# EAGLE design daq (EAGLE 9.3.0)
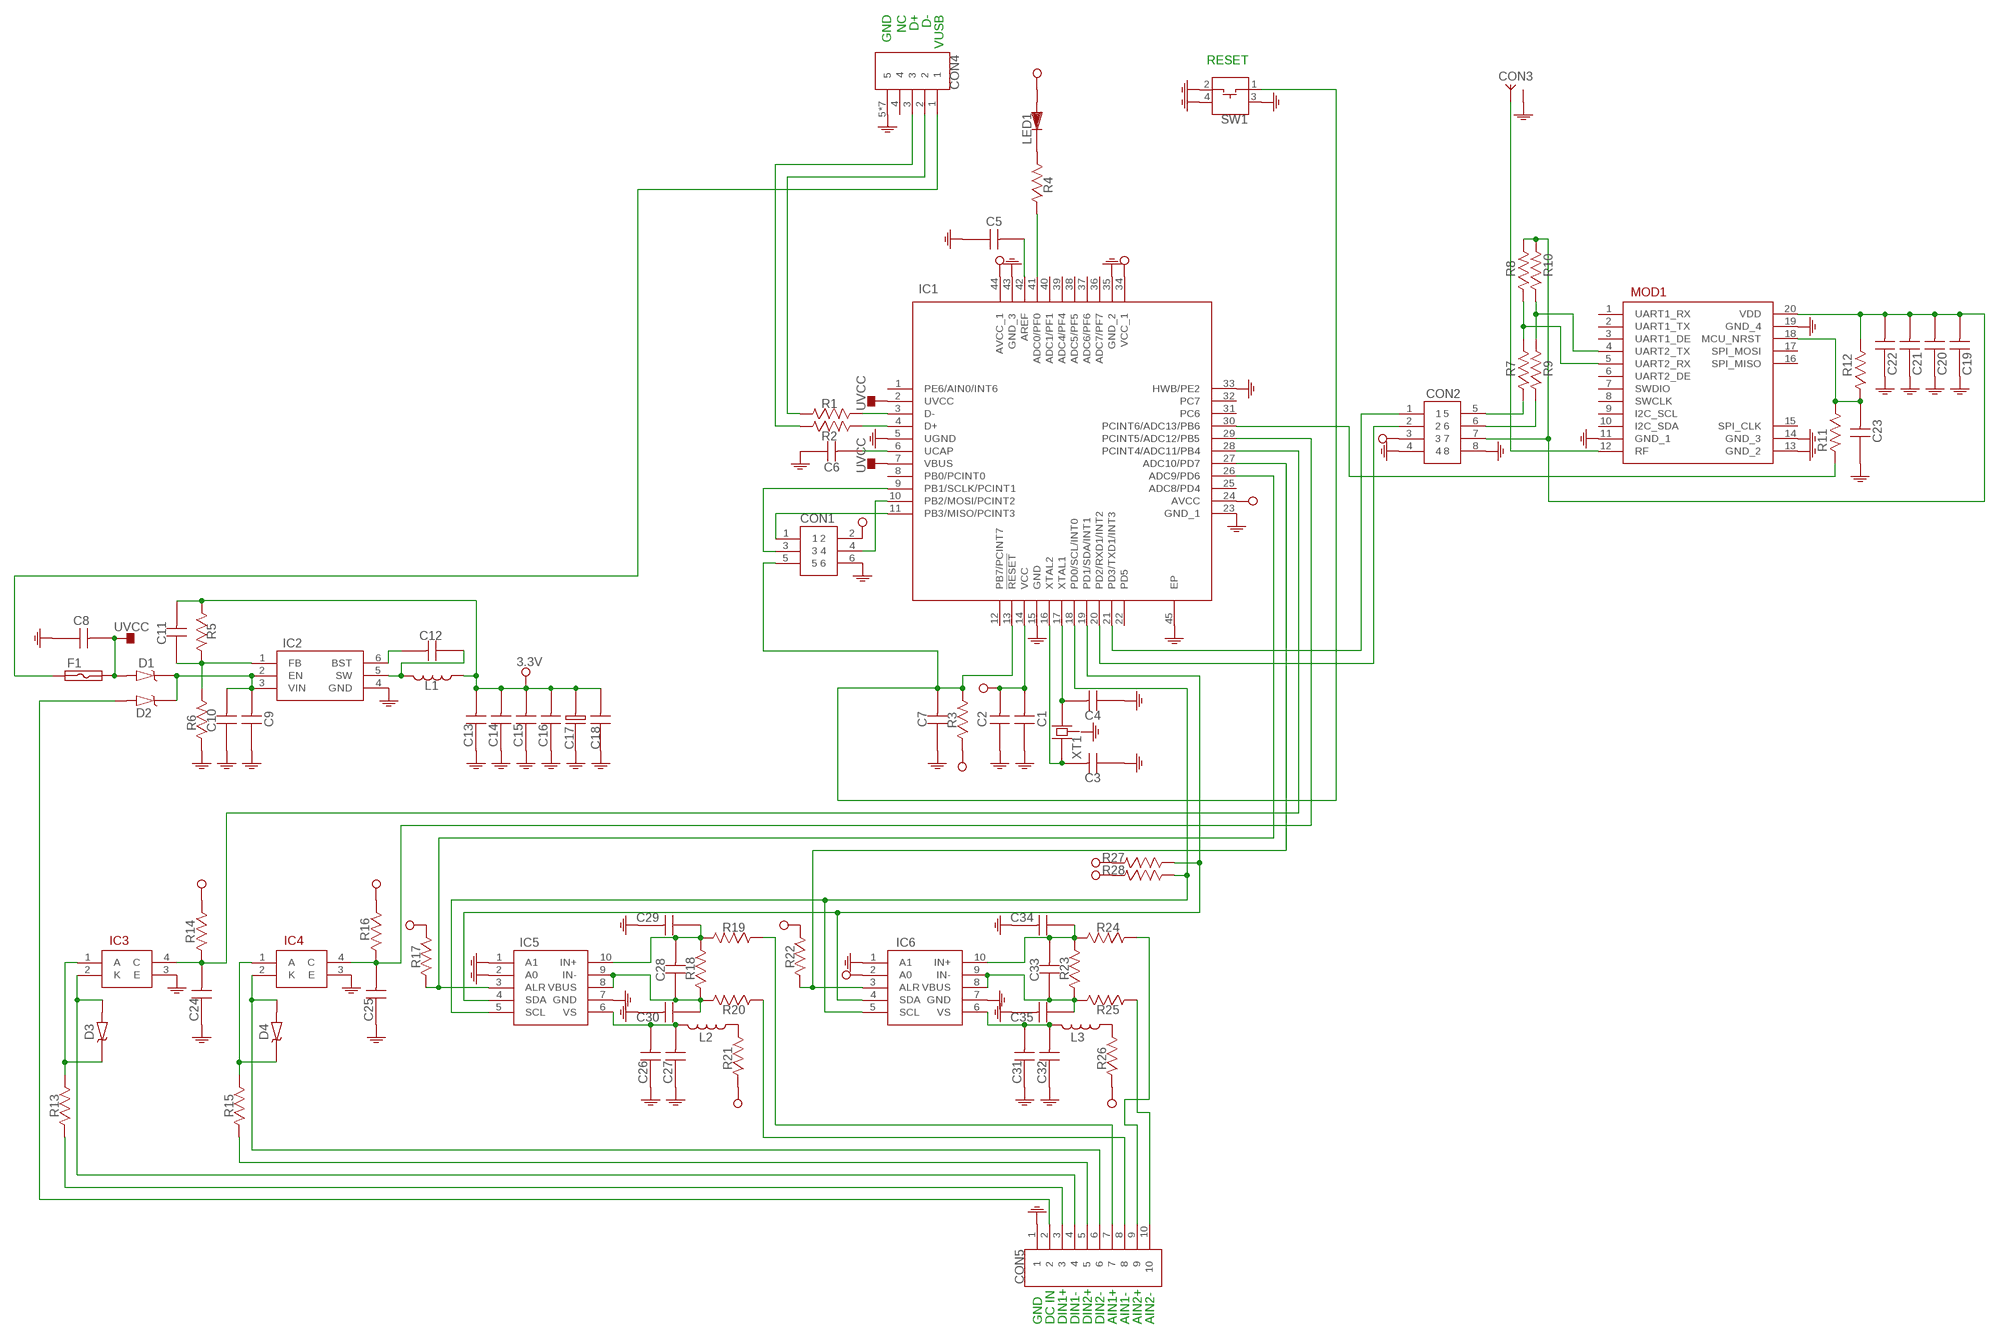
[diagram p0: schematic, sheet 1]

## Parts
C1  CAPACITOR-0603  [0603]
C2  CAPACITOR-0603  [0603]
C3  CAPACITOR-0603  [0603]
C4  CAPACITOR-0603  [0603]
C5  CAPACITOR-0603  [0603]
C6  CAPACITOR-0603  [0603]
C7  CAPACITOR-0603  [0603]
C8  CAPACITOR-0603  [0603]
C9  CAPACITOR-1206  [1206]
C10  CAPACITOR-0603  [0603]
C11  CAPACITOR-0603  [0603]
C12  CAPACITOR-0603  [0603]
C13  CAPACITOR-1206  [1206]
C14  CAPACITOR-1206  [1206]
C15  CAPACITOR-0603  [0603]
C16  CAPACITOR-0603  [0603]
C17  CAPACITOR-SMD-8  [CAPACITOR-SMD-8]
C18  CAPACITOR-0603  [0603]
C19  CAPACITOR-0603  [0603]
C20  CAPACITOR-0603  [0603]
C21  CAPACITOR-0603  [0603]
C22  CAPACITOR-0603  [0603]
C23  CAPACITOR-0603  [0603]
C24  CAPACITOR-0603  [0603]
C25  CAPACITOR-0603  [0603]
C26  CAPACITOR-0603  [0603]
C27  CAPACITOR-0603  [0603]
C28  CAPACITOR-0603  [0603]
C29  CAPACITOR-0603  [0603]
C30  CAPACITOR-0603  [0603]
C31  CAPACITOR-0603  [0603]
C32  CAPACITOR-0603  [0603]
C33  CAPACITOR-0603  [0603]
C34  CAPACITOR-0603  [0603]
C35  CAPACITOR-0603  [0603]
CON1  ISP  [ISP]
CON2  HEADER-8P-2R-DIP-2_54MM  [HEADER-8P-2R-DIP-2_54MM]
CON3  SMA-RF  [SMA-RF]
CON4  USB-MICRO-B-SMD  [USB-MICRO-B-SMD]
CON5  15EDGRC-3.81-10P  [15EDGRC-3.81-10P]
D1  DIODE-SCHOTTKY  [SOD123-DIODE]
D2  DIODE-SCHOTTKY  [SOD123-DIODE]
D3  DIODE-SCHOTTKY  [SOD123-DIODE]
D4  DIODE-SCHOTTKY  [SOD123-DIODE]
F1  FUSE-1206  [1206]
IC1  ATMEGA32U4-MU  [QFN-44]
IC2  AP63200  [SOT23-6]
IC3  OPTO-SMD  [OPTO-SMD]
IC4  OPTO-SMD  [OPTO-SMD]
IC5  INA226  [VSSOP-10]
IC6  INA226  [VSSOP-10]
L1  INDUCTOR-CDRH127R  [INDUCTOR-CDRH127R]
L2  INDUCTOR-0805  [0805]
L3  INDUCTOR-0805  [0805]
LED1  LED-3MM-RA  [LED-3MM-RA]
MOD1  RAK4200  [RAK4200]
R1  RESISTOR-0603  [0603]
R2  RESISTOR-0603  [0603]
R3  RESISTOR-0603  [0603]
R4  RESISTOR-0603  [0603]
R5  RESISTOR-0603  [0603]
R6  RESISTOR-0603  [0603]
R7  RESISTOR-0603  [0603]
R8  RESISTOR-0603  [0603]
R9  RESISTOR-0603  [0603]
R10  RESISTOR-0603  [0603]
R11  RESISTOR-0603  [0603]
R12  RESISTOR-0603  [0603]
R13  RESISTOR-0805  [0805]
R14  RESISTOR-0603  [0603]
R15  RESISTOR-0805  [0805]
R16  RESISTOR-0603  [0603]
R17  RESISTOR-0603  [0603]
R18  RESISTOR-0805  [0805]
R19  RESISTOR-0805  [0805]
R20  RESISTOR-0805  [0805]
R21  RESISTOR-0603  [0603]
R22  RESISTOR-0603  [0603]
R23  RESISTOR-0805  [0805]
R24  RESISTOR-0805  [0805]
R25  RESISTOR-0805  [0805]
R26  RESISTOR-0603  [0603]
R27  RESISTOR-0603  [0603]
R28  RESISTOR-0603  [0603]
SW1  B3F-3150-52-55  [B3F-3150-52-55]
XT1  CRYSTAL-5032-4P  [CRYSTAL-5032-4P]

## Nets
GND: C1.1 C2.1 C3.1 C4.1 C5.1 C6.1 C7.1 C8.1 C9.1 C10.1 C13.1 C14.1 C15.1 C16.1 C17.1 C18.1 C19.1 C20.1 C21.1 C22.1 C23.1 C24.1 C25.1 C26.1 C27.1 C29.2 C30.2 C31.1 C32.1 C34.2 C35.2 CON1.6 CON2.4 CON2.8 CON3.2(GND) CON3.3(GND) CON3.4(GND) CON3.5(GND) CON4.5 CON4.6 CON4.7 CON4.8 CON4.9 CON4.10 CON4.11 CON5.1 IC1.5(UGND) IC1.15(GND) IC1.23(GND_1) IC1.33(HWB/PE2) IC1.35(GND_2) IC1.43(GND_3) IC1.45(EP) IC2.4(GND) IC3.3(E) IC4.3(E) IC5.1(A1) IC5.2(A0) IC5.7(GND) IC6.1(A1) IC6.7(GND) MOD1.11(GND_1) MOD1.13(GND_2) MOD1.14(GND_3) MOD1.19(GND_4) R6.1 SW1.2 SW1.3 SW1.4
N$1: IC1.41(ADC0/PF0) R4.1
N$2: C23.2 MOD1.18(MCU_NRST) R11.1 R12.1
N$3: CON1.1 IC1.11(PB3/MISO/PCINT3)
N$4: CON3.1(ANT) MOD1.12(RF)
N$5: C28.1 C30.1 IC5.8(VBUS) IC5.9(IN-) R18.1 R20.2
N$6: MOD1.5(UART2_RX) R7.2 R8.1
N$7: CON5.2 D2.2(A)
N$8: C33.1 C35.1 IC6.8(VBUS) IC6.9(IN-) R23.1 R25.2
N$9: CON1.4 IC1.10(PB2/MOSI/PCINT2)
N$10: C3.2 IC1.16(XTAL2) XT1.1
N$11: C28.2 C29.1 IC5.10(IN+) R18.2 R19.2
N$12: C4.2 IC1.17(XTAL1) XT1.3
N$13: C19.2 C20.2 C21.2 C22.2 CON2.7 MOD1.20(VDD) R8.2 R10.2 R12.2
N$14: CON2.5 R7.1
N$15: IC1.27(ADC10/PD7) IC6.3(ALR) R22.2
N$16: CON2.6 R9.1
N$18: CON4.2 R1.1
N$19: CON4.3 R2.1
N$20: D3.1(K) IC3.1(A) R13.2
N$22: IC1.30(PCINT6/ADC13/PB6) R11.2
N$23: IC1.26(ADC9/PD6) IC5.3(ALR) R17.2
N$24: CON2.1 IC1.21(PD3/TXD1/INT3)
N$25: CON2.2 IC1.20(PD2/RXD1/INT2)
N$26: LED1.K R4.2
N$27: L3.1 R26.2
N$28: CON5.8 R20.1
N$29: CON5.7 R19.1
N$30: CON5.10 R25.1
N$31: C5.2 IC1.42(AREF)
N$32: C25.2 IC1.29(PCINT5/ADC12/PB5) IC4.4(C) R16.2
N$33: D4.1(K) IC4.1(A) R15.2
N$34: C6.2 IC1.6(UCAP)
N$35: C24.2 IC1.28(PCINT4/ADC11/PB4) IC3.4(C) R14.2
N$36: CON5.9 R24.1
N$37: MOD1.4(UART2_TX) R9.2 R10.1
N$40: C33.2 C34.1 IC6.10(IN+) R23.2 R24.2
N$41: C7.2 CON1.5 IC1.13(!RESET) R3.2 SW1.1
N$42: C31.2 C32.2 IC6.6(VS) L3.2
N$43: IC1.3(D-) R1.2
N$44: IC1.4(D+) R2.2
N$45: CON1.3 IC1.9(PB1/SCLK/PCINT1)
N$49: CON5.6 D4.2(A) IC4.2(K)
N$50: CON5.4 D3.2(A) IC3.2(K)
N$55: CON5.5 R15.1
N$56: CON4.1 F1.1
N$57: C9.2 C10.2 D1.1(K) D2.1(K) IC2.2(EN) IC2.3(VIN)
N$65: C12.2 IC2.6(BST)
N$66: C12.1 IC2.5(SW) L1.2
N$71: L2.1 R21.2
N$72: C11.1 IC2.1(FB) R5.2 R6.2
N$73: IC1.18(PD0/SCL/INT0) IC5.5(SCL) IC6.5(SCL) R28.2
N$77: C26.2 C27.2 IC5.6(VS) L2.2
N$79: IC1.19(PD1/SDA/INT1) IC5.4(SDA) IC6.4(SDA) R27.2
N$85: CON5.3 R13.1
UVCC: C8.2 D1.2(A) F1.2 IC1.2(UVCC) IC1.7(VBUS)
VCC: C1.2 C2.2 C11.2 C13.2 C14.2 C15.2 C16.2 C17.2 C18.2 CON1.2 CON2.3 IC1.14(VCC) IC1.24(AVCC) IC1.34(VCC_1) IC1.44(AVCC_1) IC6.2(A0) L1.1 LED1.A R3.1 R5.1 R14.1 R16.1 R17.1 R21.1 R22.1 R26.1 R27.1 R28.1 ; supply symbol labelled 3.3V
Unconnected: CON4.4 IC1.1(PE6/AIN0/INT6) IC1.8(PB0/PCINT0) IC1.12(PB7/PCINT7) IC1.22(PD5) IC1.25(ADC8/PD4) IC1.31(PC6) IC1.32(PC7) IC1.36(ADC7/PF7) IC1.37(ADC6/PF6) IC1.38(ADC5/PF5) IC1.39(ADC4/PF4) IC1.40(ADC1/PF1) MOD1.1(UART1_RX) MOD1.2(UART1_TX) MOD1.3(UART1_DE) MOD1.6(UART2_DE) MOD1.7(SWDIO) MOD1.8(SWCLK) MOD1.9(I2C_SCL) MOD1.10(I2C_SDA) MOD1.15(SPI_CLK) MOD1.16(SPI_MISO) MOD1.17(SPI_MOSI)

## Notes on the sheet
- GND | NC | D+ | D- | VUSB
- RESET
- GND | DC IN | DIN1+ | DIN1- | DIN2+ | DIN2- | AIN1+ | AIN1- | AIN2+ | AIN2-

## Power pins joined to a net without a drawn wire
GND: XT1.2(GND) XT1.4(GND)

## Library data of the parts
C1-C8 C10-C12 C15 C16 C18-C35 = myparts:CAPACITOR-0603
C9 C13 C14 = myparts:CAPACITOR-1206
C17 = myparts:CAPACITOR-SMD-8
CON1 = myparts:ISP
CON2 = myparts:HEADER-8P-2R-DIP-2_54MM
CON3 = myparts:SMA-RF
CON4 = myparts:USB-MICRO-B-SMD
CON5 = myparts:15EDGRC-3.81-10P
D1-D4 = myparts:DIODE-SCHOTTKY
F1 = myparts:FUSE-1206
IC1 = myparts:ATMEGA32U4-MU
IC2 = myparts:AP63200
IC3 IC4 = myparts:OPTO-SMD
IC5 IC6 = myparts:INA226
L1 = myparts:INDUCTOR-CDRH127R
L2 L3 = myparts:INDUCTOR-0805
LED1 = myparts:LED-3MM-RA
MOD1 = myparts:RAK4200
R1-R12 R14 R16 R17 R21 R22 R26-R28 = myparts:RESISTOR-0603
R13 R15 R18-R20 R23-R25 = myparts:RESISTOR-0805
SW1 = myparts:B3F-3150-52-55
XT1 = myparts:CRYSTAL-5032-4P

## Board
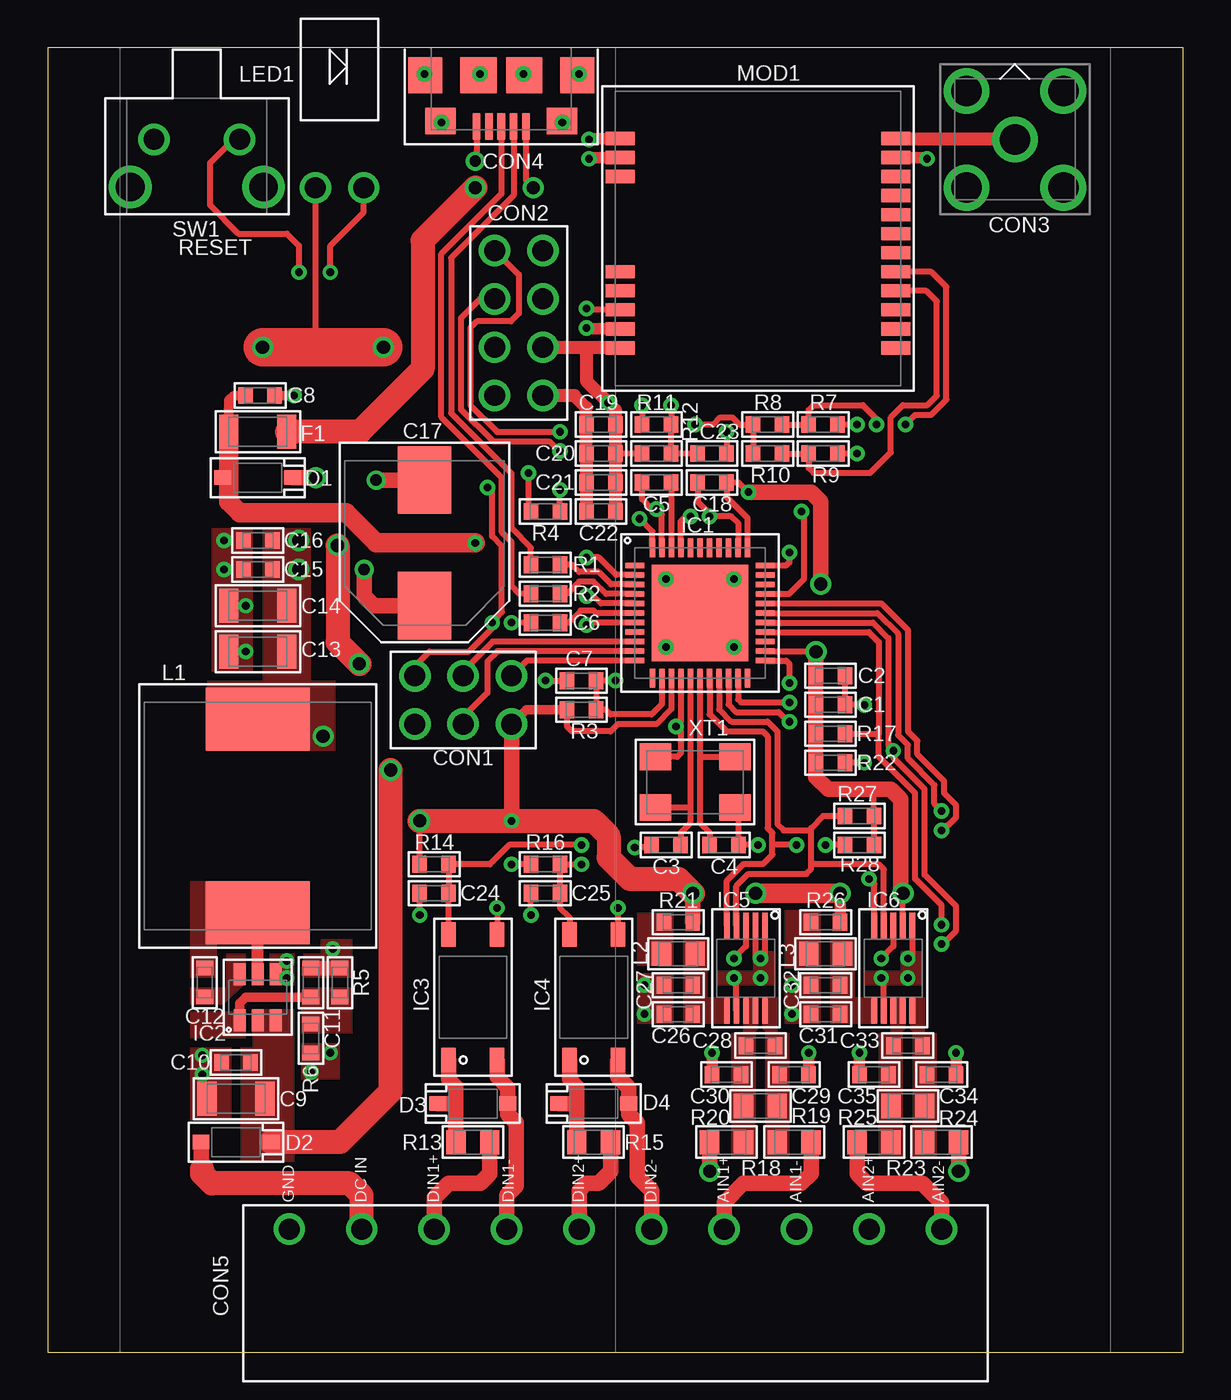
[diagram p1: board, top side]
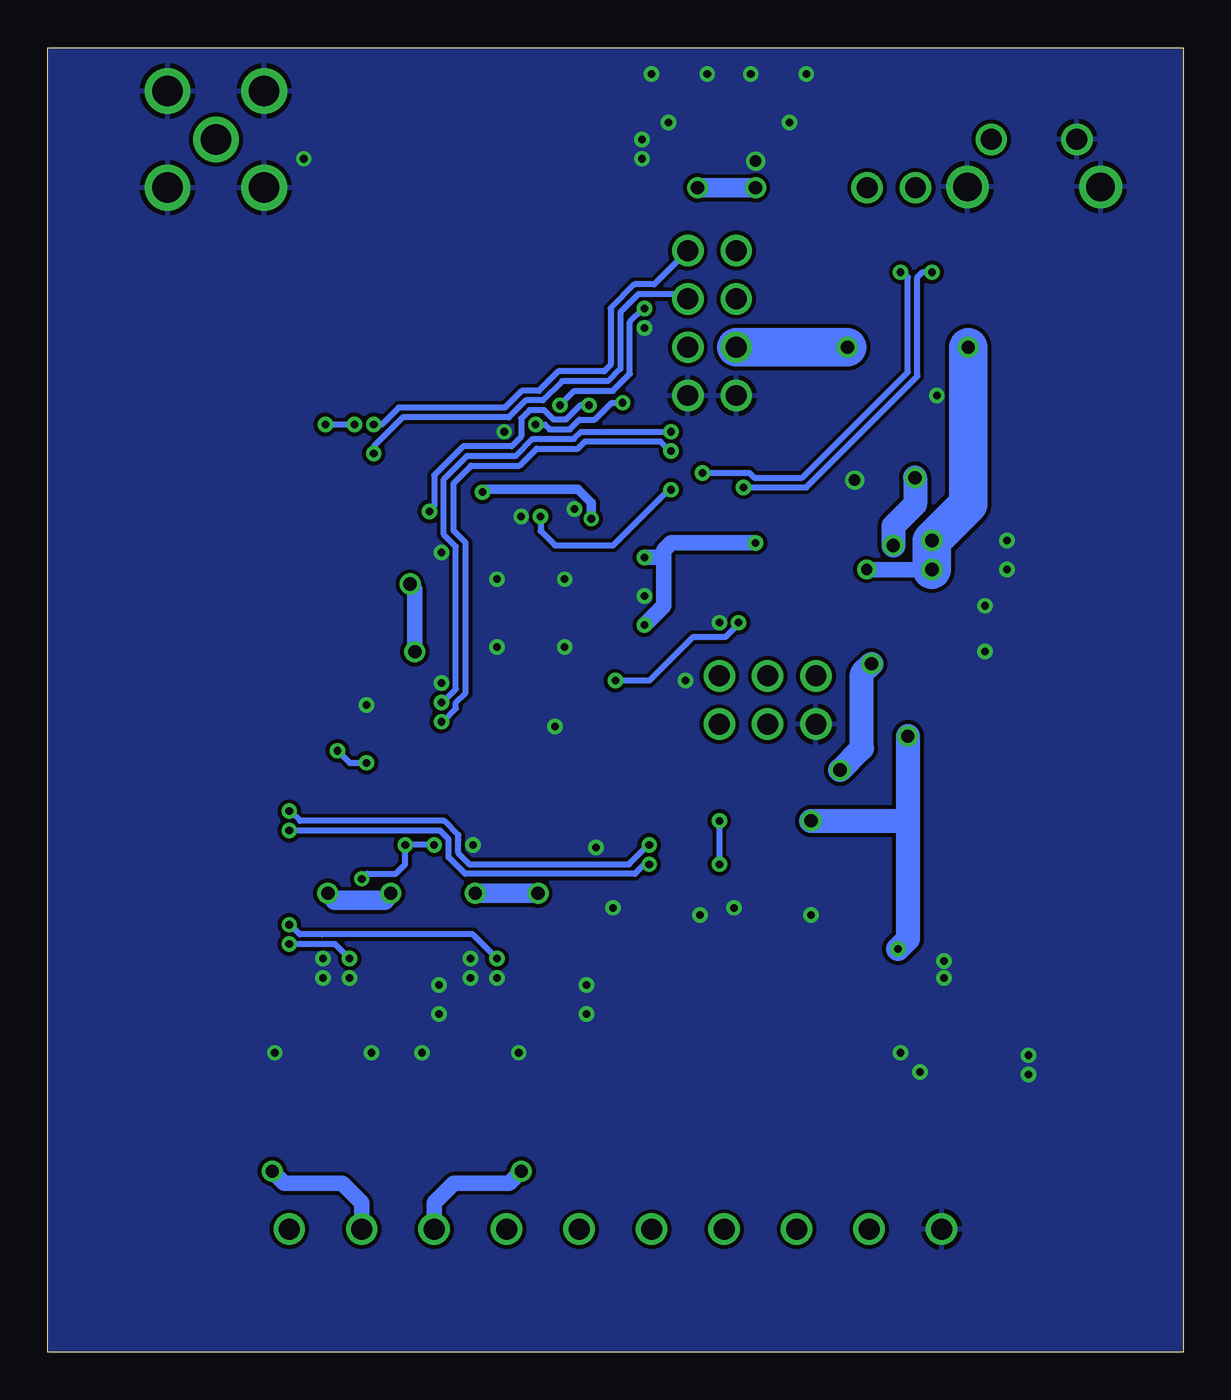
[diagram p2: board, bottom side, seen from below]

Size 59.69 x 68.58 mm. Coordinates in mm from the lower left corner, seen from the top.
Outline: 0,0 59.69,0 59.69,68.58 0,68.58 0,0
Copper layers (1*16): Top 0.035mm / dielectric 1.5mm / Bottom 0.035mm
Design rules "myparts *": minimum track width 12mil, minimum drill 0.4mm, track to track 8mil, track to pad 8mil, pad to pad 8mil, via to via 8mil, smd to smd 0mil, copper to edge 0mil, drill to drill 6mil, minimum pad ring 10mil, minimum via ring 8mil, stop-mask expansion 4mil, vias tented up to drill 28mil, thermal gap 10mil

### Footprints (pad centres in the part's own frame; a part is rotated, then mirrored left to right if it is on the bottom)
0603 = smd 0.762 x 0.889: 1 -0.762,0; 2 0.762,0
1206 = smd 1.016 x 1.778: 1 -1.524,0; 2 1.524,0
CAPACITOR-SMD-8 = smd 2.794 x 3.556: 1 0,3.302; 2 0,-3.302
ISP = drill 1.1 pad 1.65: 1 0,0; 2 2.54,0; 3 0,-2.54; 4 2.54,-2.54; 5 0,-5.08; 6 2.54,-5.08
HEADER-8P-2R-DIP-2_54MM = drill 1.1 pad 1.65: 1 0,0; 2 2.54,0; 3 5.08,0; 4 7.62,0; 5 0,2.54; 6 2.54,2.54; 7 5.08,2.54; 8 7.62,2.54
SMA-RF = drill 1.6: 1 0,0; 2 -2.54,2.54; 3 -2.54,-2.54; 4 2.54,-2.54; 5 2.54,2.54
USB-MICRO-B-SMD = smd 0.4 x 1.4: 1 -1.3,4.15; 2 -0.65,4.15; 3 0,4.15; 4 0.65,4.15; 5 1.3,4.15 | smd 1.6 x 1.4: 6 -3.2,3.85; 7 3.2,3.85 | smd 1.8 x 1.9: 8 -4,1.45; 11 4,1.45 | smd 1.9 x 1.9: 9 -1.2,1.45; 10 1.2,1.45
15EDGRC-3.81-10P = drill 1.1: 1 -17.145,0; 2 -13.335,0; 3 -9.525,0; 4 -5.715,0; 5 -1.905,0; 6 1.905,0; 7 5.715,0; 8 9.525,0; 9 13.335,0; 10 17.145,0
SOD123-DIODE = smd 0.889 x 0.762: 1 -1.841,0; 2 1.841,0
QFN-44 = smd 1.016 x 0.305: 1 -3.429,2.5; 2 -3.429,2; 3 -3.429,1.5; 4 -3.429,1; 5 -3.429,0.5; 6 -3.429,0; 7 -3.429,-0.5; 8 -3.429,-1; 9 -3.429,-1.5; 10 -3.429,-2; 11 -3.429,-2.5; 23 3.429,-2.5; 24 3.429,-2; 25 3.429,-1.5; 26 3.429,-1; 27 3.429,-0.5; 28 3.429,0; 29 3.429,0.5; 30 3.429,1; 31 3.429,1.5; 32 3.429,2; 33 3.429,2.5 | smd 0.305 x 1.016: 12 -2.5,-3.429; 13 -2,-3.429; 14 -1.5,-3.429; 15 -1,-3.429; 16 -0.5,-3.429; 17 0,-3.429; 18 0.5,-3.429; 19 1,-3.429; 20 1.5,-3.429; 21 2,-3.429; 22 2.5,-3.429; 34 2.5,3.429; 35 2,3.429; 36 1.5,3.429; 37 1,3.429; 38 0.5,3.429; 39 0,3.429; 40 -0.5,3.429; 41 -1,3.429; 42 -1.5,3.429; 43 -2,3.429; 44 -2.5,3.429 | smd 5.08 x 5.08: 45 0,0
SOT23-6 = smd 1.143 x 0.635: 1 -1.206,0.95; 2 -1.206,0; 3 -1.206,-0.95; 4 1.206,-0.95; 5 1.206,0; 6 1.206,0.95
OPTO-SMD = smd 1.27 x 0.762: 1 -3.3,1.27; 2 -3.3,-1.27; 3 3.3,-1.27; 4 3.3,1.27
VSSOP-10 = smd 1.397 x 0.3: 1 -2.223,1; 2 -2.223,0.5; 3 -2.223,0; 4 -2.223,-0.5; 5 -2.223,-1; 6 2.223,-1; 7 2.223,-0.5; 8 2.223,0; 9 2.223,0.5; 10 2.223,1
INDUCTOR-CDRH127R = smd 5.461 x 3.302: 1 0,5.08; 2 0,-5.08
0805 = smd 1.016 x 1.27: 1 -0.889,0; 2 0.889,0
LED-3MM-RA = drill 1.1 pad 1.65: A -1.27,0; K 1.27,0
RAK4200 = smd 1.524 x 0.7: 1 -7.239,5.75; 2 -7.239,4.75; 3 -7.239,3.75; 4 -7.239,2.75; 5 -7.239,1.75; 6 -7.239,0.75; 7 -7.239,-0.25; 8 -7.239,-1.25; 9 -7.239,-2.25; 10 -7.239,-3.25; 11 -7.239,-4.25; 12 -7.239,-5.25; 13 7.239,-5.25; 14 7.239,-4.25; 15 7.239,-3.25; 16 7.239,1.75; 17 7.239,2.75; 18 7.239,3.75; 19 7.239,4.75; 20 7.239,5.75
B3F-3150-52-55 = drill 1.1: 1 -2.25,0; 2 2.25,0 | drill 1.5: 3 -3.5,2.5; 4 3.5,2.5
CRYSTAL-5032-4P = smd 1.651 x 1.397: 1 -2.095,-1.333; 2 2.095,-1.333; 3 2.095,1.333; 4 -2.095,1.333

### Placement (x,y rotation side)
C1  41.15,34.04 180 top
C2  41.15,35.56 180 top
C3  32.51,26.67 0 top
C4  35.56,26.67 180 top
C5  32,45.72 0 top
C6  26.16,38.35 0 top
C7  28.07,35.31 0 top
C8  11.18,50.29 180 top
C9  9.91,13.34 0 top
C10  9.91,15.24 0 top
C11  13.84,19.43 90 top
C12  8.26,19.43 270 top
C13  11.05,36.83 0 top
C14  11.05,39.24 0 top
C15  11.05,41.15 0 top
C16  11.05,42.67 0 top
C17  19.81,42.55 0 top
C18  34.92,45.72 0 top
C19  29.08,48.77 0 top
C20  29.08,47.24 0 top
C21  29.08,45.72 0 top
C22  29.08,44.2 0 top
C23  34.92,47.24 180 top
C24  20.32,24.13 0 top
C25  26.16,24.13 0 top
C26  33.15,17.78 0 top
C27  33.15,19.3 0 top
C28  37.47,16.13 0 top
C29  39.24,14.61 0 top
C30  35.69,14.61 180 top
C31  40.89,17.78 0 top
C32  40.89,19.3 0 top
C33  45.21,16.13 0 top
C34  46.99,14.61 0 top
C35  43.43,14.61 180 top
CON1  24.38,35.56 270 top
CON2  23.5,57.91 270 top
CON3  50.84,63.75 0 top
CON4  23.84,68.58 180 top
CON5  29.84,6.48 0 top
D1  11.05,45.97 180 top
D2  9.91,11.05 180 top
D3  22.35,13.08 0 top
D4  28.7,13.08 0 top
F1  11.05,48.39 180 top
IC1  34.29,38.86 0 top
IC2  11.05,18.67 90 top
IC3  22.35,18.67 90 top
IC4  28.7,18.67 90 top
IC5  36.7,20.19 270 top
IC6  44.45,20.19 270 top
L1  11.05,28.19 0 top
L2  33.15,20.95 0 top
L3  40.89,20.95 0 top
LED1  15.35,61.21 0 top
MOD1  37.34,58.55 180 top
R1  26.16,41.4 0 top
R2  26.16,39.88 0 top
R3  28.07,33.78 0 top
R4  26.16,44.2 180 top
R5  15.37,19.43 270 top
R6  13.84,16.51 90 top
R7  40.77,48.77 180 top
R8  37.85,48.77 180 top
R9  40.77,47.24 180 top
R10  37.85,47.24 180 top
R11  32,48.77 180 top
R12  32,47.24 180 top
R13  22.35,11.05 180 top
R14  20.32,25.65 0 top
R15  28.7,11.05 180 top
R16  26.16,25.65 0 top
R17  41.15,32.51 0 top
R18  37.47,12.95 0 top
R19  39.24,11.05 180 top
R20  35.69,11.05 0 top
R21  33.15,22.61 180 top
R22  41.15,30.99 0 top
R23  45.21,12.95 0 top
R24  46.99,11.05 180 top
R25  43.43,11.05 0 top
R26  40.89,22.61 180 top
R27  42.67,28.19 180 top
R28  42.67,26.67 180 top
SW1  7.84,63.75 180 top
XT1  34.04,29.97 0 top

### Tracks (layer width: path | path; a pad name or v marks a point on that pad's centre or on a via)
GND  (via drill 0.4, 0.6)
  Top 0.305: C3.1 31.62,26.54 v30.86,26.54 | v37.34,26.67 C4.1 36.32,28.45 XT1.2 | v38.99,35.18 38.99,36.2 38.82,36.36 IC1.23 | XT1.4 33.08,31.3 33.28,31.5 33.28,32.63 v33.02,32.89 33.29,33.16 IC1.15 | v26.16,35.31 C7.1 | IC1.33 38.82,41.36 38.99,41.53 v38.99,42.04 | v28.32,39.75 28.7,39.75 29.09,39.36 IC1.5 | C6.1 v24.38,38.35 | IC1.43 32.29,44.04 v32,44.32 31.75,44.32 31.24,44.83 C5.1 | v19.81,67.18 19.68,67.18 CON4.11 | v22.73,67.18 22.68,67.13 CON4.10 | v25.02,67.18 25.02,67.13 CON4.9 | v27.94,67.18 27.89,67.13 CON4.8 | v20.7,64.64 20.62,64.73 CON4.7 | v27.05,64.64 v27.05,64.65 CON4.6 | IC5.7 36.2,19.68 v36.07,19.68 | IC5.2 37.2,20.7 v37.47,20.7 37.7,20.7 IC5.1 | IC6.7 43.95,19.55 v43.81,19.68 | IC6.1 45.45,20.94 v45.21,20.7 | C18.1 34.16,44.7 34.8,44.07 v34.8,43.94 35.94,43.94 36.29,43.59 IC1.35 | IC1.45 32.51,38.86 v32.51,40.64 | IC1.45 34.29,40.64 v36.07,40.64 | IC1.45 36.07,38.86 v36.07,37.08 | IC1.45 34.29,37.08 v32.51,37.08 | v29.97,23.37 IC4.3 | v19.56,22.99 C24.1 | v23.62,23.37 IC3.3 | v25.4,22.99 C25.1 | CON4.5 22.55,62.68 v22.48,62.61 | C2.1 C1.1 v42.93,34.04 | v35.69,48.39 C23.1
  Top 0.508: v12.95,50.29 C8.1
  Top 0.61: MOD1.13 28.49,63.8 v28.45,63.75 | MOD1.14 28.51,62.8 v28.45,62.74 | MOD1.19 28.37,53.8 v28.32,53.85 | MOD1.11 46.17,62.8 v46.23,62.74 | v34.92,15.75 C30.2 | v40.01,15.75 C29.2 | v42.67,15.75 C35.2 | v47.75,15.75 C34.2
  Top 0.686: CON2.8 27.69,50.29 28.32,49.66 C19.1 C20.1 C21.1 C22.1
  Top 0.813: v17.27,45.85 C17.1
  other vias: 9.27,42.67 9.27,41.15 10.41,39.24 10.41,36.83 12.57,20.57 12.57,19.68 14.86,15.75 8.13,15.62 8.13,14.61 31.37,19.3 31.37,17.78 39.12,19.3 39.12,17.78 37.47,19.68 45.21,19.68 13.84,14.73
  pour Bottom: 0.13,0.13 0.13,68.45 59.56,68.45 59.56,0.13
  pour Top (no thermals): 8.64,35.81 10.79,35.81 10.79,43.31 8.64,43.31
  pour Top (no thermals): 11.68,19.3 11.68,20.95 12.95,20.95 12.95,19.3
  pour Top (no thermals): 7.49,16 9.65,16 9.65,12.19 7.49,12.19
  pour Top (no thermals): 30.99,19.94 32.89,19.94 32.89,17.27 30.99,17.27
  pour Top (no thermals): 38.73,19.81 40.64,19.81 40.64,17.27 38.73,17.27
  pour Top (no thermals): 13.34,16.26 15.37,16.26 15.37,14.35 13.34,14.35
  pour Top (no thermals): 35.18,19.3 38.23,19.3 38.23,21.08 37.08,21.08 37.08,20.07 35.18,20.07
  pour Top (no thermals): 42.93,19.3 45.97,19.3 45.97,21.08 44.83,21.08 44.83,20.07 42.93,20.07
N$1  (via drill 0.4)
  Top 0.305: IC1.41 33.29,43.7 33.53,43.94 v33.78,43.94 | R4.1 v26.92,45.34
  Bottom 0.305: v33.78,43.94 33.78,43.18 33.02,42.42 29.97,42.42 27.05,45.34 v26.92,45.34
N$2  (via drill 0.4)
  Top 0.305: MOD1.18 28.39,54.8 v28.32,54.86 | v32.77,49.78 R11.1 R12.1 C23.2
  Bottom 0.305: v32.77,49.78 32.01,50.54 29.98,50.54 29.08,51.44 29.08,54.16 28.38,54.86 v28.32,54.86
N$3
  Top 0.305: CON1.1 25.19,36.36 IC1.11
N$4
  Top 0.686: MOD1.12 50.55,63.8 CON3.1
N$5
  pour Top (no thermals): 36.58,18.67 37.34,18.67 37.34,17.02 37.21,16.89 37.21,10.29 35.94,10.29 35.94,16.76 36.58,16.76
N$6  (via drill 0.4)
  Top 0.305: R8.1 R7.2 40.01,49.53 40.26,49.78 42.86,49.78 43.56,49.08 v43.56,48.77 | v45.09,48.77 45.59,49.28 46.44,49.28 47.24,50.08 47.24,56.01 46.45,56.8 MOD1.5
  Bottom 0.305: v43.56,48.77 v45.09,48.77
N$7
  Top 0.813: D2.2 8.06,9.72 8.13,9.65
  Top 1.27: CON5.2 16.51,8.26 15.88,8.89 8.64,8.89 8.13,9.4 8.13,9.65
N$8
  pour Top (no thermals): 43.69,16.76 44.32,16.76 44.32,18.67 45.09,18.67 45.09,17.02 44.96,16.89 44.96,10.29 43.69,10.29
N$9
  Top 0.305: CON1.4 21.84,33.4 23.11,34.67 23.11,36.32 23.65,36.86 IC1.10
N$10
  Top 0.305: 33.79,28.64 XT1.1 | 33.79,28.64 33.79,27.82 33.27,27.3 C3.2 | IC1.16 33.79,28.64
N$11
  pour Top (no thermals): 37.59,18.67 38.35,18.67 38.35,16.76 38.99,16.76 38.99,10.29 37.72,10.29 37.72,16.89 37.59,17.02
N$12
  Top 0.305: 34.29,31.3 XT1.3 | 34.29,31.3 34.29,27.81 34.8,27.3 C4.2 | IC1.17 34.29,31.3
N$13  (via drill 0.4)
  Top 0.305: R12.2 C20.2 | v34.04,48.77 34.98,48.77 35.36,49.15 36,49.15 36.38,48.77 R8.2 R10.2
  Top 0.686: CON2.7 26.07,52.8 28.32,52.8 | MOD1.20 28.32,52.8 | 28.32,52.8 28.32,51.05 v29.46,49.91 29.84,49.53 C19.2 C20.2 C21.2 C22.2
  Bottom 0.305: v34.04,48.77 33.55,48.77 33.3,48.52 32.24,48.52 31.73,49.02 30.93,49.02 30.04,49.91 v29.46,49.91
N$14  (via drill 0.4)
  Top 0.305: v42.55,48.77 R7.1
  Bottom 0.305: CON2.5 27.82,56.13 28.85,56.13 30.1,54.88 30.1,51.9 30.44,51.56 32.85,51.56 33.87,50.54 34.77,50.54 35.66,49.65 41.23,49.65 42.12,48.77 v42.55,48.77
N$15  (via drill 0.4)
  Top 0.305: IC6.3 44.45,21.34 v43.81,20.7 | v42.93,30.99 R22.2 | v46.99,21.46 47.05,21.46 47.75,22.16 47.75,23.45 46.1,25.1 46.1,29.61 44.45,31.26 v44.45,31.62 44.2,31.88 44.2,37.55 43.38,38.36 IC1.27
  Bottom 0.305: v43.81,20.7 44.57,21.46 45.47,21.46 v46.99,21.46 | v44.45,31.62 43.81,30.99 v42.93,30.99
N$16  (via drill 0.4)
  Top 0.305: v42.55,47.24 R9.1
  Bottom 0.305: CON2.6 26.29,55.62 28.64,55.62 29.59,54.67 29.59,51.69 30.23,51.05 32.64,51.05 33.66,50.03 34.56,50.03 35.45,49.15 41.02,49.15 42.55,47.62 v42.55,47.24
N$18
  Top 0.305: R1.1 25.4,42.29 24.38,43.31 24.38,46.19 21.21,49.36 21.21,57.53 24.5,60.82 CON4.2
N$19
  Top 0.305: R2.1 24.77,39.88 24.38,40.26 24.38,42.59 23.88,43.1 23.88,45.98 20.7,49.15 20.7,57.74 23.84,60.88 CON4.3
N$20
  Top 0.813: R13.2 21.46,13.08 | 21.46,13.08 21.46,13.97 21.08,14.35 IC3.1 | D3.1 21.46,13.08
N$22  (via drill 0.4)
  Top 0.305: v31.24,49.78 R11.2 | IC1.30 38.97,39.86 39.75,40.64 39.75,44.07 v39.62,44.2
  Bottom 0.305: v31.24,49.78 31.69,49.78 32.45,49.02 33.09,49.02 33.59,49.53 34.35,49.53 34.8,49.08 34.8,48.14 35.31,47.62 37.85,47.62 39.37,46.1 39.37,44.45 v39.62,44.2
N$23  (via drill 0.4)
  Top 0.305: IC5.3 36.7,21.34 v36.07,20.7 | v46.99,22.48 46.99,23.5 45.59,24.89 45.59,29.4 43.69,31.3 43.69,32.51 | 43.69,32.51 43.69,37.34 43.16,37.86 IC1.26 | R17.2 43.69,32.51
  Bottom 0.305: v36.07,20.7 37.34,21.97 45.26,21.97 46.42,21.97 46.93,22.48 v46.99,22.48
N$24  (via drill 0.4)
  Top 0.305: v38.99,34.16 36.45,34.16 36.29,34.32 IC1.21 | CON2.1 24.77,56.64 24.77,54.61 24.35,54.19 22.57,54.19 22.23,53.85 22.23,49.78 23.62,48.39 v26.92,48.39
  Bottom 0.305: v38.99,34.16 38.93,34.16 38.23,34.87 38.23,42.35 38.86,42.98 38.86,45.89 37.64,47.12 35.1,47.12 34.2,48.01 32.03,48.01 31.65,48.39 v26.92,48.39
N$25  (via drill 0.4)
  Top 0.305: v38.99,33.15 38.93,33.15 38.42,33.66 36.2,33.66 35.79,34.06 IC1.20 | CON2.2 22.73,55.37 21.72,54.36 21.72,49.57 23.41,47.88 26.36,47.88 26.87,47.37 v26.92,47.37
  Bottom 0.305: v38.99,33.15 38.93,33.15 38.23,33.85 38.23,34.15 37.72,34.66 37.72,42.56 38.35,43.19 38.35,45.68 37.42,46.61 34.88,46.61 33.99,47.5 31.82,47.5 31.44,47.88 27.49,47.88 26.98,47.37 v26.92,47.37
N$26  (via drill 0.4)
  Top 0.305: v25.27,46.23 25.27,44.32 R4.2 | LED1.K 16.61,59.92 14.86,58.17 v14.86,56.77
  Bottom 0.305: v25.27,46.23 22.8,46.23 22.55,45.97 20.02,45.97 14.48,51.52 14.48,56.52 14.73,56.77 v14.86,56.77
N$27
  pour Top (no thermals): 40.64,23.24 38.73,23.24 38.73,20.19 40.64,20.19
N$28  (via drill 0.7)
  Top 0.813: R20.1 v34.8,9.53
  Bottom 0.813: v34.8,9.53 35.43,8.89 38.35,8.89 39.37,7.87 CON5.8
N$29
  Top 0.813: CON5.7 35.56,7.87 36.58,8.89 39.62,8.89 40.13,9.4 R19.1
N$30
  Top 0.813: R25.1 42.55,9.4 43.05,8.89 45.97,8.89 46.99,7.87 CON5.10
N$31
  Top 0.305: C5.2 32.79,45.7 IC1.42
N$32  (via drill 0.4)
  Top 0.305: IC4.4 27.43,22.86 26.92,23.37 C25.2 R16.2 v28.07,25.65 | v46.99,27.43 47.25,27.69 47.3,27.69 47.75,28.13 47.75,28.76 47.12,29.39 47.12,30.03 45.72,31.43 45.72,32.15 45.21,32.65 45.21,37.97 43.82,39.36 IC1.29
  Bottom 0.305: v28.07,25.65 28.32,25.65 28.83,25.15 37.74,25.15 38.61,26.02 38.61,26.92 38.61,26.93 38.61,26.98 39.06,27.43 v46.99,27.43
N$33
  Top 0.813: R15.2 27.81,13.08 | 27.81,13.08 27.81,13.97 27.43,14.35 IC4.1 | D4.1 27.81,13.08
N$34
  Top 0.305: C6.2 27.38,38.35 28.01,38.99 28.7,38.99 28.83,38.86 IC1.6
N$35  (via drill 0.4)
  Top 0.305: IC3.4 C24.2 R14.2 23.24,25.65 24.26,26.67 v28.07,26.67 | v46.99,28.45 46.61,28.83 46.61,29.82 45.21,31.22 45.21,31.94 44.7,32.44 44.7,37.76 43.6,38.86 IC1.28
  Bottom 0.305: v28.07,26.67 28.12,26.67 29.14,25.66 37.52,25.66 38.1,26.23 38.1,26.92 38.1,27.19 38.84,27.94 46.42,27.94 46.93,28.45 v46.99,28.45
N$36  (via drill 0.7)
  Top 0.813: v47.88,9.53 R24.1
  Bottom 0.813: v47.88,9.53 47.24,8.89 44.2,8.89 43.18,7.87 CON5.9
N$37
  Top 0.305: R10.1 R9.2 40.01,46.48 40.26,46.23 43.24,46.23 44.32,47.31 44.32,49.15 44.96,49.78 46.23,49.78 46.74,50.29 46.74,55.24 46.18,55.8 MOD1.4
N$40
  pour Top (no thermals): 45.34,18.67 45.34,17.02 45.47,16.89 45.47,10.29 46.74,10.29 46.74,16.76 46.1,16.76 46.1,18.67
N$41  (via drill 0.4)
  Top 0.305: CON1.5 19.3,36.07 20.07,36.83 22.14,36.83 23.37,38.06 v23.37,38.35 23.62,38.61 23.62,38.67 23.88,38.92 23.88,42.38 23.37,42.89 23.37,45.21 v23.11,45.47 | SW1.1 9.78,63.75 8.54,62.52 8.54,60.29 10.03,58.8 12.57,58.8 13.21,58.17 v13.21,56.77 | v29.84,35.31 C7.2 R3.2 29.34,33.78 29.59,33.53 31.75,33.53 32.29,34.07 IC1.13
  Bottom 0.305: v23.37,38.35 23.37,38.3 24.07,37.59 25.78,37.59 28.07,35.31 v29.84,35.31 | v23.11,45.47 19.81,45.47 13.97,51.31 13.97,56.52 13.72,56.77 v13.21,56.77
N$42
  pour Top (no thermals): 41.15,21.72 42.42,21.72 42.42,18.67 43.56,18.67 43.56,17.27 41.15,17.27
N$43
  Top 0.305: R1.2 27.56,41.4 27.94,41.02 28.96,41.02 29.61,40.36 IC1.3
N$44
  Top 0.305: R2.2 27.3,39.88 27.94,40.51 28.7,40.51 29.35,39.86 IC1.4
N$45
  Top 0.305: CON1.3 21.84,35.81 23.39,37.36 IC1.9
N$49
  Top 0.813: CON5.6 31.75,8.51 30.99,9.27 30.99,12.06 30.54,12.51 D4.2 30.54,13.91 29.97,14.48 IC4.2
N$50
  Top 0.813: CON5.4 24.13,8.26 24.64,8.76 24.64,12.06 24.19,12.51 D3.2 24.19,13.91 23.62,14.48 IC3.2
N$55
  Top 0.813: R15.1 29.59,9.53 28.96,8.89 28.32,8.89 27.94,8.51 CON5.5
N$56  (via drill 0.7)
  Top 0.305: CON4.1 25.14,61.6 v25.53,61.21
  Top 1.27: v22.48,61.21 19.71,58.45 19.71,51.69 16.41,48.39 F1.1
  Bottom 1.016: v25.53,61.21 v22.48,61.21
N$57  (via drill 0.7)
  Top 0.813: D1.1 v14.1,45.97
  Top 1.27: D2.1 15.37,11.05 18.03,13.72 v18.03,30.61 | v16.38,36.2 15.24,37.34 v15.24,42.42
  Bottom 1.27: v14.1,45.97 14.1,44.58 15.24,43.43 v15.24,42.42 | v18.03,30.61 16.89,31.75 16.89,35.69 v16.38,36.2
  pour Top (no thermals): 10.79,18.03 12.95,18.03 12.95,16 10.79,16
  pour Top (no thermals): 12.95,16 10.16,16 10.16,10.03 12.95,10.03
N$65
  pour Top (no thermals): 7.49,18.29 9.27,18.29 10.41,19.43 10.41,20.95 9.4,20.95 9.4,19.18 7.49,19.18
N$66
  Top 0.61: 11.05,21.84 L1.2
  Top 0.635: IC2.5 11.05,21.84
  pour Top (no thermals): 7.49,19.68 8.89,19.68 8.89,21.46 13.72,21.46 13.72,24.77 7.49,24.77
N$71
  pour Top (no thermals): 30.99,20.32 32.89,20.32 32.89,23.11 30.99,23.11
N$72
  Top 0.508: IC2.1 10.1,18.35 10.41,18.67 C11.1
  pour Top (no thermals): 13.34,16.76 13.34,18.41 13.46,18.41 13.46,19.18 16,19.18 16,16.76
  pour Top (no thermals): 10.41,17.91 10.41,16.51 7.49,16.51 7.49,17.91
N$73  (via drill 0.4)
  Top 0.305: IC6.5 43.45,24.62 v43.18,24.89 | IC5.5 35.7,24.78 36.6,25.67 37.61,25.67 38.1,26.16 38.1,26.67 | R28.2 v40.89,26.67 | 38.1,26.67 38.1,27.3 37.85,27.56 37.85,32.38 37.59,32.64 35.69,32.64 34.79,33.54 IC1.18 | v39.37,26.67 38.1,26.67
  Bottom 0.305: v43.18,24.89 42.91,25.17 41.38,25.17 40.89,25.65 v40.89,26.67 v39.37,26.67
N$77
  pour Top (no thermals): 33.4,21.72 34.67,21.72 34.67,18.67 35.81,18.67 35.81,17.27 33.4,17.27
N$79
  Top 0.305: IC5.4 36.2,24.52 36.83,25.15 39.88,25.15 40.13,25.4 40.13,25.65 | 40.13,25.65 40.13,26.98 40.13,26.99 40.13,27.43 | 40.13,27.43 40.13,27.56 40.77,28.19 R27.2 | 40.13,27.43 38.69,27.43 38.35,27.77 38.35,32.64 37.85,33.15 35.94,33.15 35.29,33.8 IC1.19 | 40.13,25.65 43.69,25.65 43.95,25.39 IC6.4
N$85
  Top 0.813: R13.1 23.24,9.4 22.73,8.89 21.08,8.89 20.32,8.13 CON5.3
UVCC  (via drill 0.4)
  Top 0.305: IC1.7 28.46,38.36 v28.32,38.23 | v28.32,41.78 28.96,41.78 29.88,40.86 IC1.2
  Top 0.508: C8.2 9.78,50.29 9.53,50.04 F1.2
  Top 0.813: D1.2 9.53,45.97
  Top 1.016: F1.2 9.53,45.97 9.53,44.7 10.11,44.12 15.7,44.12 17.27,42.55 v22.48,42.55
  Bottom 0.813: 27.3,41.78 27.3,42.16 26.92,42.55 v22.48,42.55 | 27.3,41.78 27.3,39.24 v28.32,38.23 | v28.32,41.78 27.3,41.78
VCC  (via drill 0.4, 0.6, 0.7)
  Top 0.305: IC1.44 31.79,43.14 v31.11,43.81 | IC6.2 v44.95,24.12 v44.96,24.13 | IC1.34 36.79,43.85 35.69,44.96 C18.2 36.32,45.72 v36.83,45.21 | R16.1 v24.38,25.65 | R14.1 v19.56,27.94 | 43.43,29.59 R27.1 R28.1 | R3.1 27.3,32.89 27.56,32.64 29.59,32.64 29.97,33.02 32,33.02 32.79,33.81 IC1.14 | IC1.24 40.35,36.86 v40.39,36.83 | LED1.A 14.07,52.85 14.1,52.83
  Top 0.508: CON1.2 25.15,33.78 R3.1
  Top 0.61: v41.66,24.13 R26.1
  Top 0.762: C11.2 R5.1
  Top 0.813: R21.1 v33.91,24.13 | v44.96,24.13 44.83,24.26 44.83,29.08 44.32,29.59 43.43,29.59 41.02,29.59 40.39,30.23 R22.1 R17.1 C1.2 C2.2 v40.39,36.83 | v36.83,45.21 40.13,45.21 40.64,44.71 v40.64,40.39 | CON1.2 v24.38,27.94 | v16.64,41.15 16.64,39.75 17.14,39.24 C17.2
  Top 1.016: v41.66,24.13 v37.21,24.13
  Top 1.27: v33.91,24.13 33.15,24.89 30.61,24.89 29.49,26.01 29.49,27.15 28.7,27.94 v24.38,27.94 v19.56,27.94
  Top 2.032: v11.3,52.83 14.1,52.83 v17.65,52.83
  Bottom 0.305: v24.38,27.94 v24.38,25.65
  Bottom 0.508: v31.11,43.81 31.11,44.65 31.83,45.36 36.68,45.36 v36.83,45.21
  Bottom 0.813: v40.64,40.39 40.39,40.13 v40.39,36.83 | v13.21,41.15 v16.64,41.15
  Bottom 1.016: v41.66,24.13 41.66,24.08 41.96,23.78 44.61,23.78 v44.96,24.13 | v37.21,24.13 v33.91,24.13
  Bottom 1.27: v14.48,32.38 14.48,27.94 | 14.48,27.94 14.48,21.72 v14.99,21.21 | v19.56,27.94 14.48,27.94
  Bottom 2.032: v13.21,41.15 v13.21,42.67 11.3,44.58 v11.3,52.83 | CON2.3 v17.65,52.83
  pour Top (no thermals): 13.46,19.68 16,19.68 16,21.72 14.35,21.72 14.35,20.95 13.46,20.95
  pour Top (no thermals): 8.38,31.62 8.38,35.31 11.3,35.31 11.3,43.31 13.84,43.31 13.84,35.31 15.11,35.31 15.11,31.62

### Text on the board
tPlace: RESET | GND | DC IN | DIN1+ | DIN1- | DIN2+ | DIN2- | AIN1+ | AIN1- | AIN2+ | AIN2-